# Altium schematic sheet Сalibrator.SchDoc: Наименование
size 420 x 297 mm; ApprovedBy: Утвердил; CheckedBy: Проверил; Author: Разработал; CompanyName: Организация; DrawnBy: Н.Контр; Engineer: Т.Контр; SheetNumber: 1; SheetTotal: 1; PageSetup: Record=PageOptions|CenterHorizontal=True|CenterVertical=True|PrintScale=0.94|XCorrection=1.00|YCorrection=1.00|PrintKind=1|BorderSize=5000000|LeftOffset=0|BottomOffset=0|Orientation=1|PaperLength=1000|PaperWidth=1000|Scale=100|PaperSource=7|PrintQuality=-4|MediaType=1|DitherType=10|PaperKind=A4|PrintScaleMode=1; DecimalNumber: Децимальный номер; HeadOfSector: Нач. сектора; MainDevice: Перв.примен.; Name: Наименование; DocumentName: Sheet1.SCHDOC
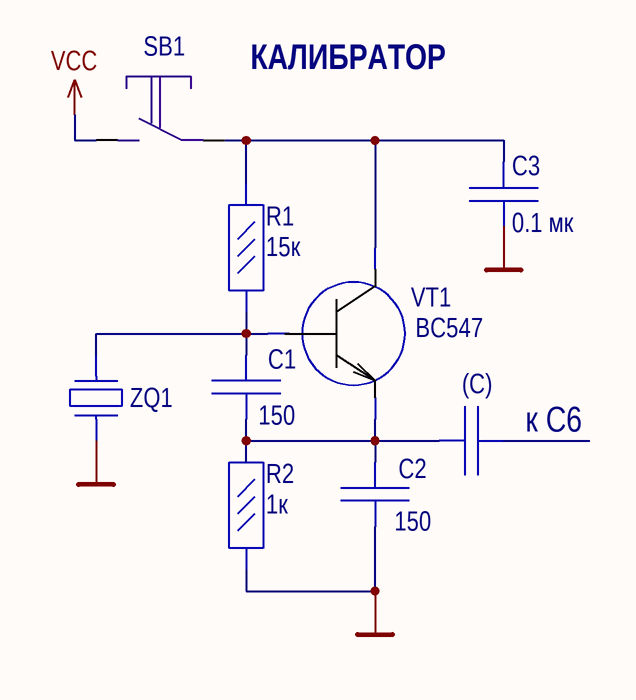
[diagram p0: Сalibrator.SchDoc]

## Parts
(C)  (no value)  [К10-17Б]
C1  150  [К10-17Б]
C2  150  [К10-17Б]
C3  0.1 мк  [К10-17Б]
R1  15к  [С1-4]
R2  1к  [С1-4]
SB1  KLS7-TS6601  [KLS7-TS6601]  (value not drawn)
VT1  BC547  [КТ-26]
ZQ1  HC-49U  [HC-49U]  (value not drawn)

## Nets
GND: C2.2 C3.1 R2.1 ZQ1.2
VCC: SB1.1
Net(C)_2: (C).2 C1.2 C2.1 R2.2 VT1.3(E)
NetC1_1: C1.1 R1.1 VT1.2(B) ZQ1.1
NetC3_2: C3.2 R1.2 SB1.2 VT1.1(C)

Not connected (* = marked no-connect by the designer): (C) 1

## Notes on the sheet
- (near SB1) КАЛИБРАТОР
- (near (C)) к С6
- Перв.примен.
- Справ.№
- Подп. и дата
- Инв.№ дубл.
- Взам.инв.№
- Подп.и дата
- Разраб.
- Изм.
- Лист
- № докум.
- Подп.
- Дата
- Лит.
- Масштаб
- Масса
- Т.контр.
- Пров.
- СХЕМА   ЭЛЕКТРИЧЕСКАЯ
- ПРИНЦИПИАЛЬНАЯ
- Листов
- Инв.№ подл.
- Утв.
- Н.контр.
- Нач.сект.
- Формат  A3

## Library data of the parts
(C) C1-C3 = C_К10-17Б
R1 R2 = R_C1-4